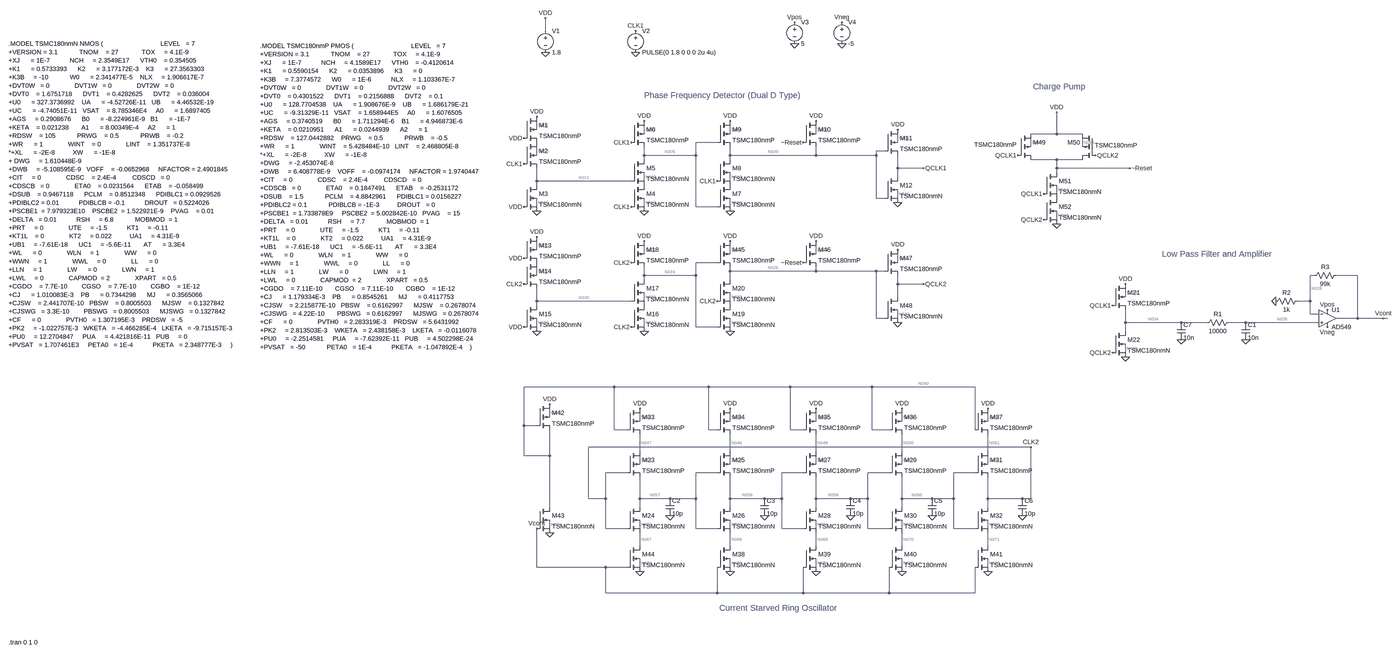
[diagram p0: schematic Clock-Multiplier.asc, whole sheet]
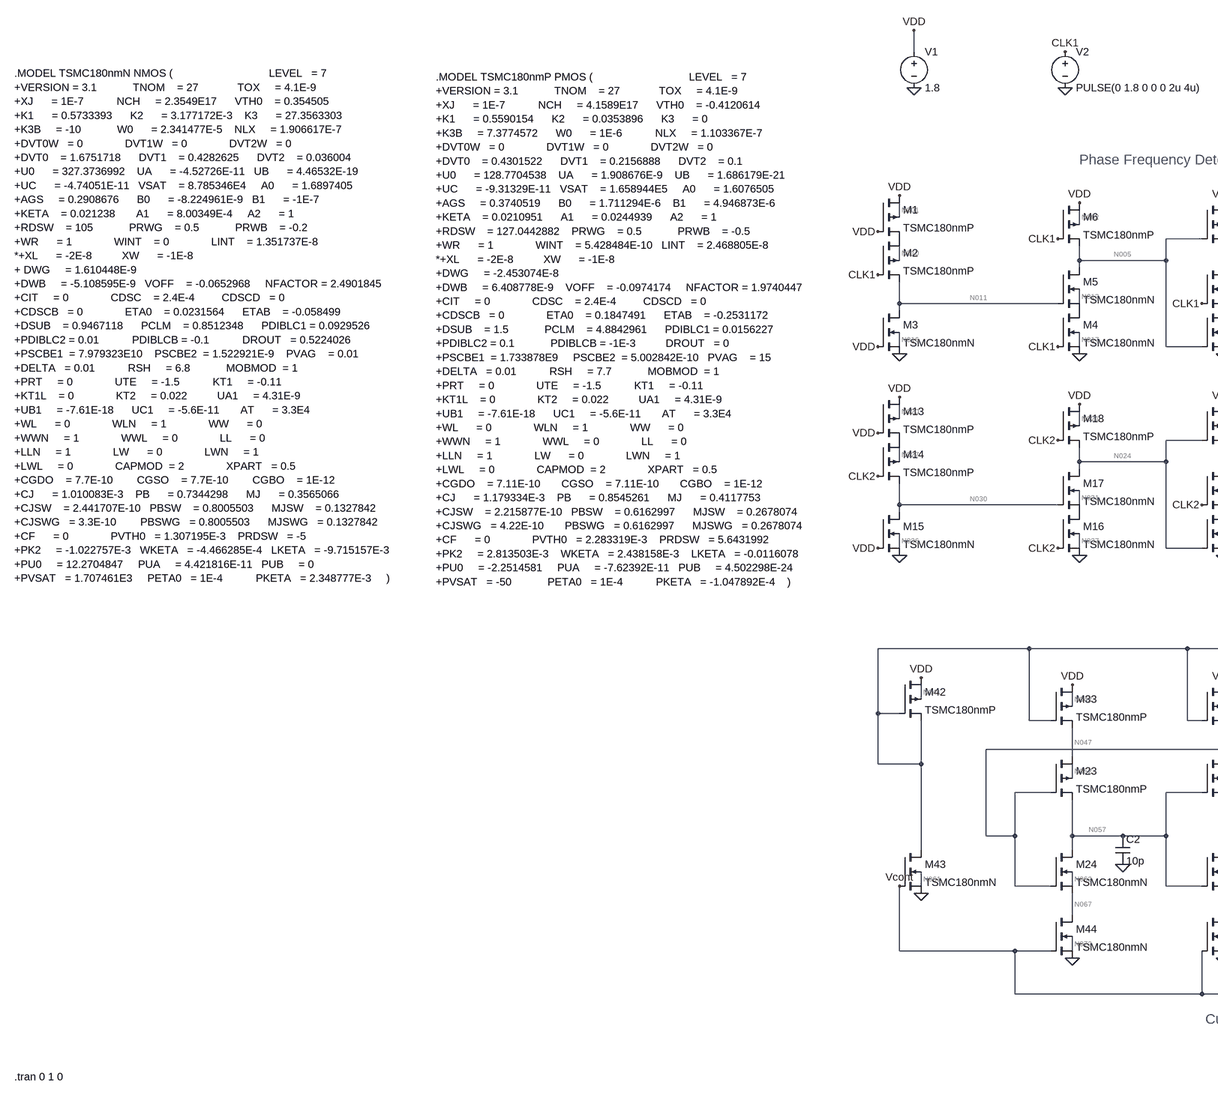
[diagram p1: schematic Clock-Multiplier.asc, part, row 1 of 1, column 1 of 2]
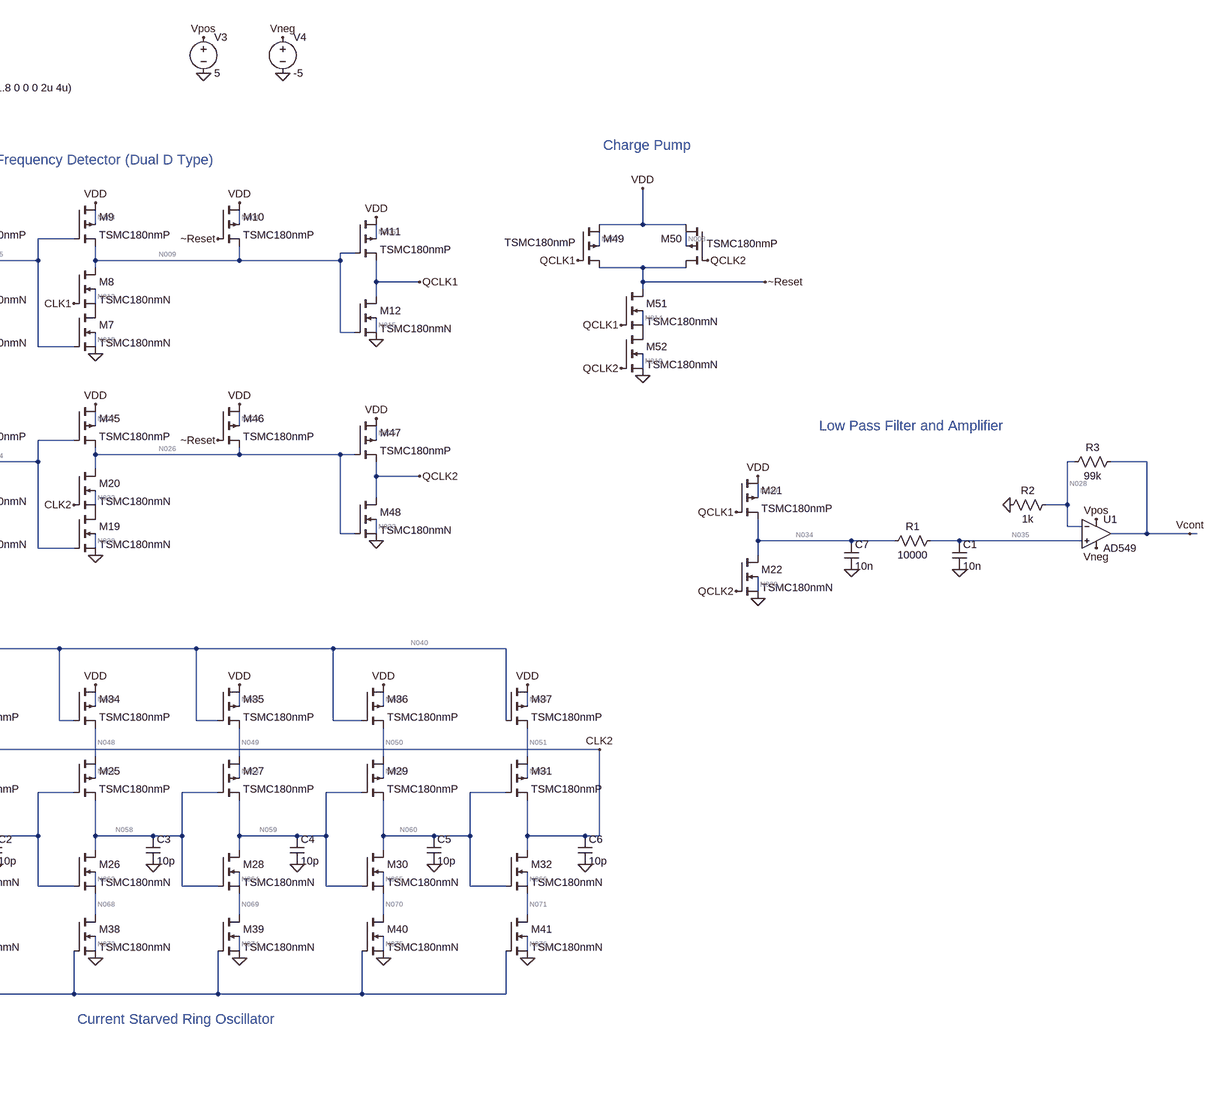
[diagram p2: schematic Clock-Multiplier.asc, part, row 1 of 1, column 2 of 2]
Clock-Multiplier.asc, the LTspice schematic file:
Version 4
SHEET 1 5760 2408
WIRE 1152 -832 1152 -880
WIRE 1120 -464 1120 -496
WIRE 1520 -448 1520 -480
WIRE 1840 -448 1840 -480
WIRE 2160 -448 2160 -480
WIRE 3056 -448 3056 -528
WIRE 3056 -448 2960 -448
WIRE 3152 -448 3056 -448
WIRE 1792 -416 1712 -416
WIRE 2464 -416 2464 -448
WIRE 2960 -400 2960 -432
WIRE 3152 -400 3152 -432
WIRE 2416 -384 2384 -384
WIRE 1120 -368 1120 -400
WIRE 1520 -368 1520 -400
WIRE 1712 -368 1712 -416
WIRE 1712 -368 1520 -368
WIRE 1840 -368 1840 -400
WIRE 2160 -368 2160 -400
WIRE 2160 -368 1840 -368
WIRE 2384 -368 2384 -384
WIRE 2384 -368 2160 -368
WIRE 1520 -352 1520 -368
WIRE 1840 -352 1840 -368
WIRE 3056 -352 2960 -352
WIRE 3152 -352 3056 -352
WIRE 2464 -320 2464 -368
WIRE 2560 -320 2464 -320
WIRE 3056 -320 3056 -352
WIRE 3328 -320 3056 -320
WIRE 3056 -304 3056 -320
WIRE 2464 -288 2464 -320
WIRE 1120 -272 1120 -320
WIRE 1472 -272 1120 -272
WIRE 1520 -272 1520 -304
WIRE 1840 -272 1840 -304
WIRE 1120 -256 1120 -272
WIRE 3056 -224 3056 -256
WIRE 2384 -208 2384 -368
WIRE 2416 -208 2384 -208
WIRE 2464 -208 2464 -240
WIRE 1120 -176 1120 -208
WIRE 1520 -176 1520 -208
WIRE 1712 -176 1712 -368
WIRE 1792 -176 1712 -176
WIRE 1840 -176 1840 -208
WIRE 3056 -128 3056 -160
WIRE 1120 -16 1120 -48
WIRE 1520 0 1520 -32
WIRE 1840 0 1840 -32
WIRE 2160 0 2160 -32
WIRE 1792 32 1712 32
WIRE 2464 32 2464 0
WIRE 1840 64 1840 48
WIRE 2160 64 2160 48
WIRE 2160 64 1840 64
WIRE 2384 64 2160 64
WIRE 2416 64 2384 64
WIRE 1120 80 1120 48
WIRE 1520 80 1520 48
WIRE 1712 80 1712 32
WIRE 1712 80 1520 80
WIRE 4016 80 4000 80
WIRE 4176 80 4096 80
WIRE 1520 96 1520 80
WIRE 1840 96 1840 64
WIRE 2464 112 2464 80
WIRE 2560 112 2464 112
WIRE 2464 160 2464 112
WIRE 3312 160 3312 128
WIRE 1120 176 1120 128
WIRE 1472 176 1120 176
WIRE 1520 176 1520 144
WIRE 1840 176 1840 144
WIRE 4000 176 4000 80
WIRE 4000 176 3952 176
WIRE 1120 192 1120 176
WIRE 4000 224 4000 176
WIRE 4032 224 4000 224
WIRE 2384 240 2384 64
WIRE 2416 240 2384 240
WIRE 2464 240 2464 208
WIRE 4176 240 4176 80
WIRE 4176 240 4096 240
WIRE 4272 240 4176 240
WIRE 4288 240 4272 240
WIRE 3312 256 3312 208
WIRE 3520 256 3312 256
WIRE 3616 256 3520 256
WIRE 3760 256 3696 256
WIRE 4032 256 3760 256
WIRE 1120 272 1120 240
WIRE 1520 272 1520 240
WIRE 1712 272 1712 80
WIRE 1792 272 1712 272
WIRE 1840 272 1840 240
WIRE 3312 288 3312 256
WIRE 3312 368 3312 336
WIRE 1408 496 1072 496
WIRE 1760 496 1408 496
WIRE 2064 496 1760 496
WIRE 2368 496 2064 496
WIRE 2752 496 2368 496
WIRE 1168 608 1168 576
WIRE 1504 624 1504 592
WIRE 1840 624 1840 592
WIRE 2160 624 2160 592
WIRE 2480 624 2480 592
WIRE 2800 624 2800 592
WIRE 1072 640 1072 496
WIRE 1120 640 1072 640
WIRE 1408 656 1408 496
WIRE 1456 656 1408 656
WIRE 1760 656 1760 496
WIRE 1792 656 1760 656
WIRE 2064 656 2064 496
WIRE 2112 656 2064 656
WIRE 2368 656 2368 496
WIRE 2432 656 2368 656
WIRE 2752 656 2752 496
WIRE 2960 720 1312 720
WIRE 1504 736 1504 672
WIRE 1840 736 1840 672
WIRE 2160 736 2160 672
WIRE 2480 736 2480 672
WIRE 2800 736 2800 672
WIRE 1072 752 1072 640
WIRE 1168 752 1168 656
WIRE 1168 752 1072 752
WIRE 1504 784 1504 752
WIRE 1840 784 1840 752
WIRE 2160 784 2160 752
WIRE 2480 784 2480 752
WIRE 2800 784 2800 752
WIRE 1456 816 1376 816
WIRE 1792 816 1712 816
WIRE 2112 816 2032 816
WIRE 2432 816 2352 816
WIRE 2752 816 2672 816
WIRE 1312 912 1312 720
WIRE 1376 912 1376 816
WIRE 1376 912 1312 912
WIRE 1504 912 1504 832
WIRE 1616 912 1504 912
WIRE 1712 912 1712 816
WIRE 1712 912 1616 912
WIRE 1840 912 1840 832
WIRE 1968 912 1840 912
WIRE 2032 912 2032 816
WIRE 2032 912 1968 912
WIRE 2160 912 2160 832
WIRE 2288 912 2160 912
WIRE 2352 912 2352 816
WIRE 2352 912 2288 912
WIRE 2480 912 2480 832
WIRE 2592 912 2480 912
WIRE 2672 912 2672 816
WIRE 2672 912 2592 912
WIRE 2800 912 2800 832
WIRE 2928 912 2800 912
WIRE 2960 912 2960 720
WIRE 2960 912 2928 912
WIRE 1168 944 1168 752
WIRE 1504 944 1504 912
WIRE 1840 944 1840 912
WIRE 2160 944 2160 912
WIRE 2480 944 2480 912
WIRE 2800 944 2800 912
WIRE 1168 1024 1168 992
WIRE 1376 1024 1376 912
WIRE 1456 1024 1376 1024
WIRE 1504 1024 1504 992
WIRE 1712 1024 1712 912
WIRE 1792 1024 1712 1024
WIRE 1840 1024 1840 992
WIRE 2032 1024 2032 912
WIRE 2112 1024 2032 1024
WIRE 2160 1024 2160 992
WIRE 2352 1024 2352 912
WIRE 2432 1024 2352 1024
WIRE 2480 1024 2480 992
WIRE 2672 1024 2672 912
WIRE 2752 1024 2672 1024
WIRE 2800 1024 2800 992
WIRE 1504 1088 1504 1040
WIRE 1840 1088 1840 1040
WIRE 2160 1088 2160 1040
WIRE 2480 1088 2480 1040
WIRE 2800 1088 2800 1040
WIRE 1120 1168 1120 1024
WIRE 1376 1168 1120 1168
WIRE 1456 1168 1376 1168
WIRE 1504 1168 1504 1136
WIRE 1840 1168 1840 1136
WIRE 2160 1168 2160 1136
WIRE 2480 1168 2480 1136
WIRE 2800 1168 2800 1136
WIRE 1376 1264 1376 1168
WIRE 1792 1264 1792 1168
WIRE 1792 1264 1376 1264
WIRE 2112 1264 2112 1168
WIRE 2112 1264 1792 1264
WIRE 2432 1264 2432 1168
WIRE 2432 1264 2112 1264
WIRE 2752 1264 2752 1168
WIRE 2752 1264 2432 1264
FLAG 1152 -880 VDD
FLAG 1152 -752 0
FLAG 1488 -832 CLK1
FLAG 1488 -752 0
FLAG 1840 1184 0
FLAG 2160 1184 0
FLAG 2480 1184 0
FLAG 2800 1184 0
FLAG 1504 576 VDD
FLAG 1840 576 VDD
FLAG 2160 576 VDD
FLAG 2480 576 VDD
FLAG 2800 576 VDD
FLAG 1168 1040 0
FLAG 1504 1184 0
FLAG 1168 560 VDD
FLAG 2960 720 CLK2
FLAG 1120 -160 0
FLAG 1520 -160 0
FLAG 1120 -512 VDD
FLAG 1520 -496 VDD
FLAG 1840 -160 0
FLAG 1840 -496 VDD
FLAG 2160 -496 VDD
FLAG 2464 -464 VDD
FLAG 2464 -192 0
FLAG 1120 288 0
FLAG 1520 288 0
FLAG 1120 -64 VDD
FLAG 1520 -48 VDD
FLAG 1840 288 0
FLAG 1840 -48 VDD
FLAG 2160 -48 VDD
FLAG 2464 -16 VDD
FLAG 2464 256 0
FLAG 1072 -432 VDD
FLAG 1072 -176 VDD
FLAG 1072 -336 CLK1
FLAG 1072 16 VDD
FLAG 1072 272 VDD
FLAG 1472 -416 CLK1
FLAG 1472 -176 CLK1
FLAG 1792 -272 CLK1
FLAG 1072 112 CLK2
FLAG 1472 32 CLK2
FLAG 1472 272 CLK2
FLAG 1792 176 CLK2
FLAG 3056 -112 0
FLAG 3056 -528 VDD
FLAG 2560 -320 QCLK1
FLAG 2560 112 QCLK2
FLAG 2912 -368 QCLK1
FLAG 3008 -224 QCLK1
FLAG 3008 -128 QCLK2
FLAG 3200 -368 QCLK2
FLAG 3328 -320 ~Reset
FLAG 2112 -416 ~Reset
FLAG 2112 32 ~Reset
FLAG 3264 192 QCLK1
FLAG 3264 368 QCLK2
FLAG 3760 320 0
FLAG 1616 976 0
FLAG 1968 976 0
FLAG 2288 976 0
FLAG 2592 976 0
FLAG 2928 976 0
FLAG 3312 112 VDD
FLAG 3312 384 0
FLAG 1120 1024 Vcont
FLAG 3520 320 0
FLAG 2080 -784 0
FLAG 2080 -864 Vpos
FLAG 2256 -784 0
FLAG 2256 -864 Vneg
FLAG 4064 208 Vpos
FLAG 4064 272 Vneg
FLAG 3872 176 0
FLAG 4272 240 Vcont
SYMBOL voltage 1152 -848 R0
WINDOW 123 0 0 Left 0
WINDOW 39 0 0 Left 0
SYMATTR InstName V1
SYMATTR Value 1.8
SYMBOL voltage 1488 -848 R0
WINDOW 123 0 0 Left 0
WINDOW 39 0 0 Left 0
SYMATTR InstName V2
SYMATTR Value PULSE(0 1.8 0 0 0 2u 4u)
SYMBOL pmos4 3264 112 R0
SYMATTR InstName M21
SYMATTR Value TSMC180nmP
SYMBOL nmos4 3264 288 R0
SYMATTR InstName M22
SYMATTR Value TSMC180nmN
SYMBOL pmos4 1456 736 R0
SYMATTR InstName M23
SYMATTR Value TSMC180nmP
SYMBOL nmos4 1456 944 R0
SYMATTR InstName M24
SYMATTR Value TSMC180nmN
SYMBOL pmos4 1792 736 R0
SYMATTR InstName M25
SYMATTR Value TSMC180nmP
SYMBOL nmos4 1792 944 R0
SYMATTR InstName M26
SYMATTR Value TSMC180nmN
SYMBOL pmos4 2112 736 R0
SYMATTR InstName M27
SYMATTR Value TSMC180nmP
SYMBOL nmos4 2112 944 R0
SYMATTR InstName M28
SYMATTR Value TSMC180nmN
SYMBOL pmos4 2432 736 R0
SYMATTR InstName M29
SYMATTR Value TSMC180nmP
SYMBOL nmos4 2432 944 R0
SYMATTR InstName M30
SYMATTR Value TSMC180nmN
SYMBOL pmos4 2752 736 R0
SYMATTR InstName M31
SYMATTR Value TSMC180nmP
SYMBOL nmos4 2752 944 R0
SYMATTR InstName M32
SYMATTR Value TSMC180nmN
SYMBOL pmos4 1456 576 R0
SYMATTR InstName M33
SYMATTR Value TSMC180nmP
SYMBOL pmos4 1792 576 R0
SYMATTR InstName M34
SYMATTR Value TSMC180nmP
SYMBOL pmos4 2112 576 R0
SYMATTR InstName M35
SYMATTR Value TSMC180nmP
SYMBOL pmos4 2432 576 R0
SYMATTR InstName M36
SYMATTR Value TSMC180nmP
SYMBOL pmos4 2752 576 R0
SYMATTR InstName M37
SYMATTR Value TSMC180nmP
SYMBOL nmos4 1792 1088 R0
SYMATTR InstName M38
SYMATTR Value TSMC180nmN
SYMBOL nmos4 2112 1088 R0
SYMATTR InstName M39
SYMATTR Value TSMC180nmN
SYMBOL nmos4 2432 1088 R0
SYMATTR InstName M40
SYMATTR Value TSMC180nmN
SYMBOL nmos4 2752 1088 R0
SYMATTR InstName M41
SYMATTR Value TSMC180nmN
SYMBOL pmos4 1120 560 R0
SYMATTR InstName M42
SYMATTR Value TSMC180nmP
SYMBOL nmos4 1120 944 R0
SYMATTR InstName M43
SYMATTR Value TSMC180nmN
SYMBOL nmos4 1456 1088 R0
SYMATTR InstName M44
SYMATTR Value TSMC180nmN
SYMBOL pmos4 1072 -512 R0
SYMATTR InstName M1
SYMATTR Value TSMC180nmP
SYMBOL pmos4 1072 -416 R0
SYMATTR InstName M2
SYMATTR Value TSMC180nmP
SYMBOL nmos4 1072 -256 R0
SYMATTR InstName M3
SYMATTR Value TSMC180nmN
SYMBOL nmos4 1472 -256 R0
SYMATTR InstName M4
SYMATTR Value TSMC180nmN
SYMBOL nmos4 1472 -352 R0
SYMATTR InstName M5
SYMATTR Value TSMC180nmN
SYMBOL pmos4 1472 -496 R0
SYMATTR InstName M6
SYMATTR Value TSMC180nmP
SYMBOL nmos4 1792 -256 R0
SYMATTR InstName M7
SYMATTR Value TSMC180nmN
SYMBOL nmos4 1792 -352 R0
SYMATTR InstName M8
SYMATTR Value TSMC180nmN
SYMBOL pmos4 1792 -496 R0
SYMATTR InstName M9
SYMATTR Value TSMC180nmP
SYMBOL pmos4 2112 -496 R0
SYMATTR InstName M10
SYMATTR Value TSMC180nmP
SYMBOL pmos4 2416 -464 R0
SYMATTR InstName M11
SYMATTR Value TSMC180nmP
SYMBOL nmos4 2416 -288 R0
SYMATTR InstName M12
SYMATTR Value TSMC180nmN
SYMBOL pmos4 1072 -64 R0
SYMATTR InstName M13
SYMATTR Value TSMC180nmP
SYMBOL pmos4 1072 32 R0
SYMATTR InstName M14
SYMATTR Value TSMC180nmP
SYMBOL nmos4 1072 192 R0
SYMATTR InstName M15
SYMATTR Value TSMC180nmN
SYMBOL nmos4 1472 192 R0
SYMATTR InstName M16
SYMATTR Value TSMC180nmN
SYMBOL nmos4 1472 96 R0
SYMATTR InstName M17
SYMATTR Value TSMC180nmN
SYMBOL pmos4 1472 -48 R0
SYMATTR InstName M18
SYMATTR Value TSMC180nmP
SYMBOL nmos4 1792 192 R0
SYMATTR InstName M19
SYMATTR Value TSMC180nmN
SYMBOL nmos4 1792 96 R0
SYMATTR InstName M20
SYMATTR Value TSMC180nmN
SYMBOL pmos4 1792 -48 R0
SYMATTR InstName M45
SYMATTR Value TSMC180nmP
SYMBOL pmos4 2112 -48 R0
SYMATTR InstName M46
SYMATTR Value TSMC180nmP
SYMBOL pmos4 2416 -16 R0
SYMATTR InstName M47
SYMATTR Value TSMC180nmP
SYMBOL nmos4 2416 160 R0
SYMATTR InstName M48
SYMATTR Value TSMC180nmN
SYMBOL pmos4 2912 -448 R0
WINDOW 3 -163 40 Left 2
SYMATTR InstName M49
SYMATTR Value TSMC180nmP
SYMBOL pmos4 3200 -448 M0
WINDOW 3 -156 43 Left 2
SYMATTR InstName M50
SYMATTR Value TSMC180nmP
SYMBOL nmos4 3008 -304 R0
SYMATTR InstName M51
SYMATTR Value TSMC180nmN
SYMBOL nmos4 3008 -208 R0
SYMATTR InstName M52
SYMATTR Value TSMC180nmN
SYMBOL res 3712 240 R90
WINDOW 0 0 56 VBottom 2
WINDOW 3 32 56 VTop 2
SYMATTR InstName R1
SYMATTR Value 10000
SYMBOL cap 3744 256 R0
SYMATTR InstName C1
SYMATTR Value 10n
SYMBOL cap 1600 912 R0
SYMATTR InstName C2
SYMATTR Value 10p
SYMBOL cap 1952 912 R0
SYMATTR InstName C3
SYMATTR Value 10p
SYMBOL cap 2272 912 R0
SYMATTR InstName C4
SYMATTR Value 10p
SYMBOL cap 2576 912 R0
SYMATTR InstName C5
SYMATTR Value 10p
SYMBOL cap 2912 912 R0
SYMATTR InstName C6
SYMATTR Value 10p
SYMBOL cap 3504 256 R0
SYMATTR InstName C7
SYMATTR Value 10n
SYMBOL Opamps\\AD549 4064 176 R0
SYMATTR InstName U1
SYMBOL voltage 2080 -880 R0
WINDOW 123 0 0 Left 0
WINDOW 39 0 0 Left 0
SYMATTR InstName V3
SYMATTR Value 5
SYMBOL voltage 2256 -880 R0
WINDOW 123 0 0 Left 0
WINDOW 39 0 0 Left 0
SYMATTR InstName V4
SYMATTR Value -5
SYMBOL res 3968 160 R90
WINDOW 0 0 56 VBottom 2
WINDOW 3 32 56 VTop 2
SYMATTR InstName R2
SYMATTR Value 1k
SYMBOL res 4112 64 R90
WINDOW 0 0 56 VBottom 2
WINDOW 3 32 56 VTop 2
SYMATTR InstName R3
SYMATTR Value 99k
TEXT -1072 -784 Left 2 !.MODEL TSMC180nmN NMOS (                                LEVEL   = 7\n+VERSION = 3.1            TNOM    = 27             TOX     = 4.1E-9\n+XJ      = 1E-7           NCH     = 2.3549E17      VTH0    = 0.354505\n+K1      = 0.5733393      K2      = 3.177172E-3    K3      = 27.3563303\n+K3B     = -10            W0      = 2.341477E-5    NLX     = 1.906617E-7\n+DVT0W   = 0              DVT1W   = 0              DVT2W   = 0\n+DVT0    = 1.6751718      DVT1    = 0.4282625      DVT2    = 0.036004\n+U0      = 327.3736992    UA      = -4.52726E-11   UB      = 4.46532E-19\n+UC      = -4.74051E-11   VSAT    = 8.785346E4     A0      = 1.6897405\n+AGS     = 0.2908676      B0      = -8.224961E-9   B1      = -1E-7\n+KETA    = 0.021238       A1      = 8.00349E-4     A2      = 1\n+RDSW    = 105            PRWG    = 0.5            PRWB    = -0.2\n+WR      = 1              WINT    = 0              LINT    = 1.351737E-8\n*+XL      = -2E-8          XW      = -1E-8         \n+ DWG     = 1.610448E-9\n+DWB     = -5.108595E-9   VOFF    = -0.0652968     NFACTOR = 2.4901845\n+CIT     = 0              CDSC    = 2.4E-4         CDSCD   = 0\n+CDSCB   = 0              ETA0    = 0.0231564      ETAB    = -0.058499\n+DSUB    = 0.9467118      PCLM    = 0.8512348      PDIBLC1 = 0.0929526\n+PDIBLC2 = 0.01           PDIBLCB = -0.1           DROUT   = 0.5224026\n+PSCBE1  = 7.979323E10    PSCBE2  = 1.522921E-9    PVAG    = 0.01\n+DELTA   = 0.01           RSH     = 6.8            MOBMOD  = 1\n+PRT     = 0              UTE     = -1.5           KT1     = -0.11\n+KT1L    = 0              KT2     = 0.022          UA1     = 4.31E-9\n+UB1     = -7.61E-18      UC1     = -5.6E-11       AT      = 3.3E4\n+WL      = 0              WLN     = 1              WW      = 0\n+WWN     = 1              WWL     = 0              LL      = 0\n+LLN     = 1              LW      = 0              LWN     = 1\n+LWL     = 0              CAPMOD  = 2              XPART   = 0.5\n+CGDO    = 7.7E-10        CGSO    = 7.7E-10        CGBO    = 1E-12\n+CJ      = 1.010083E-3    PB      = 0.7344298      MJ      = 0.3565066\n+CJSW    = 2.441707E-10   PBSW    = 0.8005503      MJSW    = 0.1327842\n+CJSWG   = 3.3E-10        PBSWG   = 0.8005503      MJSWG   = 0.1327842\n+CF      = 0              PVTH0   = 1.307195E-3    PRDSW   = -5\n+PK2     = -1.022757E-3   WKETA   = -4.466285E-4   LKETA   = -9.715157E-3\n+PU0     = 12.2704847     PUA     = 4.421816E-11   PUB     = 0\n+PVSAT   = 1.707461E3     PETA0   = 1E-4           PKETA   = 2.348777E-3     )
TEXT -120 -776 Left 2 !.MODEL TSMC180nmP PMOS (                                LEVEL   = 7\n+VERSION = 3.1            TNOM    = 27             TOX     = 4.1E-9\n+XJ      = 1E-7           NCH     = 4.1589E17      VTH0    = -0.4120614\n+K1      = 0.5590154      K2      = 0.0353896      K3      = 0\n+K3B     = 7.3774572      W0      = 1E-6           NLX     = 1.103367E-7\n+DVT0W   = 0              DVT1W   = 0              DVT2W   = 0\n+DVT0    = 0.4301522      DVT1    = 0.2156888      DVT2    = 0.1\n+U0      = 128.7704538    UA      = 1.908676E-9    UB      = 1.686179E-21\n+UC      = -9.31329E-11   VSAT    = 1.658944E5     A0      = 1.6076505\n+AGS     = 0.3740519      B0      = 1.711294E-6    B1      = 4.946873E-6\n+KETA    = 0.0210951      A1      = 0.0244939      A2      = 1\n+RDSW    = 127.0442882    PRWG    = 0.5            PRWB    = -0.5\n+WR      = 1              WINT    = 5.428484E-10   LINT    = 2.468805E-8\n*+XL      = -2E-8          XW      = -1E-8          \n+DWG     = -2.453074E-8\n+DWB     = 6.408778E-9    VOFF    = -0.0974174     NFACTOR = 1.9740447\n+CIT     = 0              CDSC    = 2.4E-4         CDSCD   = 0\n+CDSCB   = 0              ETA0    = 0.1847491      ETAB    = -0.2531172\n+DSUB    = 1.5            PCLM    = 4.8842961      PDIBLC1 = 0.0156227\n+PDIBLC2 = 0.1            PDIBLCB = -1E-3          DROUT   = 0\n+PSCBE1  = 1.733878E9     PSCBE2  = 5.002842E-10   PVAG    = 15\n+DELTA   = 0.01           RSH     = 7.7            MOBMOD  = 1\n+PRT     = 0              UTE     = -1.5           KT1     = -0.11\n+KT1L    = 0              KT2     = 0.022          UA1     = 4.31E-9\n+UB1     = -7.61E-18      UC1     = -5.6E-11       AT      = 3.3E4\n+WL      = 0              WLN     = 1              WW      = 0\n+WWN     = 1              WWL     = 0              LL      = 0\n+LLN     = 1              LW      = 0              LWN     = 1\n+LWL     = 0              CAPMOD  = 2              XPART   = 0.5\n+CGDO    = 7.11E-10       CGSO    = 7.11E-10       CGBO    = 1E-12\n+CJ      = 1.179334E-3    PB      = 0.8545261      MJ      = 0.4117753\n+CJSW    = 2.215877E-10   PBSW    = 0.6162997      MJSW    = 0.2678074\n+CJSWG   = 4.22E-10       PBSWG   = 0.6162997      MJSWG   = 0.2678074\n+CF      = 0              PVTH0   = 2.283319E-3    PRDSW   = 5.6431992\n+PK2     = 2.813503E-3    WKETA   = 2.438158E-3    LKETA   = -0.0116078\n+PU0     = -2.2514581     PUA     = -7.62392E-11   PUB     = 4.502298E-24\n+PVSAT   = -50            PETA0   = 1E-4           PKETA   = -1.047892E-4    )
TEXT -1072 1448 Left 2 !.tran 0 1 0
TEXT 1800 1320 Left 3 ;Current Starved Ring Oscillator
TEXT 1520 -592 Left 3 ;Phase Frequency Detector (Dual D Type)
TEXT 2968 -624 Left 3 ;Charge Pump
TEXT 3448 0 Left 3 ;Low Pass Filter and Amplifier

The netlist it stands for:
* Clock-Multiplier.asc
V1 VDD 0 1.8
V2 CLK1 0 PULSE(0 1.8 0 0 0 2u 4u)
M21 VDD QCLK1 N034 N029 TSMC180nmP
M22 N034 QCLK2 0 N039 TSMC180nmN
M23 N047 CLK2 N057 N052 TSMC180nmP
M24 N057 CLK2 N067 N062 TSMC180nmN
M25 N048 N057 N058 N053 TSMC180nmP
M26 N058 N057 N068 N063 TSMC180nmN
M27 N049 N058 N059 N054 TSMC180nmP
M28 N059 N058 N069 N064 TSMC180nmN
M29 N050 N059 N060 N055 TSMC180nmP
M30 N060 N059 N070 N065 TSMC180nmN
M31 N051 N060 CLK2 N056 TSMC180nmP
M32 CLK2 N060 N071 N066 TSMC180nmN
M33 VDD N040 N047 N042 TSMC180nmP
M34 VDD N040 N048 N043 TSMC180nmP
M35 VDD N040 N049 N044 TSMC180nmP
M36 VDD N040 N050 N045 TSMC180nmP
M37 VDD N040 N051 N046 TSMC180nmP
M38 N068 Vcont 0 N073 TSMC180nmN
M39 N069 Vcont 0 N074 TSMC180nmN
M40 N070 Vcont 0 N075 TSMC180nmN
M41 N071 Vcont 0 N076 TSMC180nmN
M42 VDD N040 N040 N041 TSMC180nmP
M43 N040 Vcont 0 N061 TSMC180nmN
M44 N067 Vcont 0 N072 TSMC180nmN
M1 VDD VDD P001 N001 TSMC180nmP
M2 P001 CLK1 N011 N010 TSMC180nmP
M3 N011 VDD 0 N016 TSMC180nmN
M4 P002 CLK1 0 N017 TSMC180nmN
M5 N005 N011 P002 N012 TSMC180nmN
M6 VDD CLK1 N005 N002 TSMC180nmP
M7 P003 N005 0 N018 TSMC180nmN
M8 N009 CLK1 P003 N013 TSMC180nmN
M9 VDD N005 N009 N003 TSMC180nmP
M10 VDD ~Reset N009 N004 TSMC180nmP
M11 VDD N009 QCLK1 N006 TSMC180nmP
M12 QCLK1 N009 0 N015 TSMC180nmN
M13 VDD VDD P004 N020 TSMC180nmP
M14 P004 CLK2 N030 N027 TSMC180nmP
M15 N030 VDD 0 N036 TSMC180nmN
M16 P005 CLK2 0 N037 TSMC180nmN
M17 N024 N030 P005 N031 TSMC180nmN
M18 VDD CLK2 N024 N021 TSMC180nmP
M19 P006 N024 0 N038 TSMC180nmN
M20 N026 CLK2 P006 N032 TSMC180nmN
M45 VDD N024 N026 N022 TSMC180nmP
M46 VDD ~Reset N026 N023 TSMC180nmP
M47 VDD N026 QCLK2 N025 TSMC180nmP
M48 QCLK2 N026 0 N033 TSMC180nmN
M49 VDD QCLK1 ~Reset N007 TSMC180nmP
M50 VDD QCLK2 ~Reset N008 TSMC180nmP
M51 ~Reset QCLK1 P007 N014 TSMC180nmN
M52 P007 QCLK2 0 N019 TSMC180nmN
R1 N035 N034 10000
C1 N035 0 10n
C2 N057 0 10p
C3 N058 0 10p
C4 N059 0 10p
C5 N060 0 10p
C6 CLK2 0 10p
C7 N034 0 10n
XU1 N035 N028 Vpos Vneg Vcont AD549  ; pins In+ In- V+ V- OUT
V3 Vpos 0 5
V4 Vneg 0 -5
R2 N028 0 1k
R3 Vcont N028 99k
.model NMOS NMOS
.model PMOS PMOS
.lib standard.mos
.MODEL TSMC180nmN NMOS (                                LEVEL   = 7
+VERSION = 3.1            TNOM    = 27             TOX     = 4.1E-9
+XJ      = 1E-7           NCH     = 2.3549E17      VTH0    = 0.354505
+K1      = 0.5733393      K2      = 3.177172E-3    K3      = 27.3563303
+K3B     = -10            W0      = 2.341477E-5    NLX     = 1.906617E-7
+DVT0W   = 0              DVT1W   = 0              DVT2W   = 0
+DVT0    = 1.6751718      DVT1    = 0.4282625      DVT2    = 0.036004
+U0      = 327.3736992    UA      = -4.52726E-11   UB      = 4.46532E-19
+UC      = -4.74051E-11   VSAT    = 8.785346E4     A0      = 1.6897405
+AGS     = 0.2908676      B0      = -8.224961E-9   B1      = -1E-7
+KETA    = 0.021238       A1      = 8.00349E-4     A2      = 1
+RDSW    = 105            PRWG    = 0.5            PRWB    = -0.2
+WR      = 1              WINT    = 0              LINT    = 1.351737E-8
*+XL      = -2E-8          XW      = -1E-8
+ DWG     = 1.610448E-9
+DWB     = -5.108595E-9   VOFF    = -0.0652968     NFACTOR = 2.4901845
+CIT     = 0              CDSC    = 2.4E-4         CDSCD   = 0
+CDSCB   = 0              ETA0    = 0.0231564      ETAB    = -0.058499
+DSUB    = 0.9467118      PCLM    = 0.8512348      PDIBLC1 = 0.0929526
+PDIBLC2 = 0.01           PDIBLCB = -0.1           DROUT   = 0.5224026
+PSCBE1  = 7.979323E10    PSCBE2  = 1.522921E-9    PVAG    = 0.01
+DELTA   = 0.01           RSH     = 6.8            MOBMOD  = 1
+PRT     = 0              UTE     = -1.5           KT1     = -0.11
+KT1L    = 0              KT2     = 0.022          UA1     = 4.31E-9
+UB1     = -7.61E-18      UC1     = -5.6E-11       AT      = 3.3E4
+WL      = 0              WLN     = 1              WW      = 0
+WWN     = 1              WWL     = 0              LL      = 0
+LLN     = 1              LW      = 0              LWN     = 1
+LWL     = 0              CAPMOD  = 2              XPART   = 0.5
+CGDO    = 7.7E-10        CGSO    = 7.7E-10        CGBO    = 1E-12
+CJ      = 1.010083E-3    PB      = 0.7344298      MJ      = 0.3565066
+CJSW    = 2.441707E-10   PBSW    = 0.8005503      MJSW    = 0.1327842
+CJSWG   = 3.3E-10        PBSWG   = 0.8005503      MJSWG   = 0.1327842
+CF      = 0              PVTH0   = 1.307195E-3    PRDSW   = -5
+PK2     = -1.022757E-3   WKETA   = -4.466285E-4   LKETA   = -9.715157E-3
+PU0     = 12.2704847     PUA     = 4.421816E-11   PUB     = 0
+PVSAT   = 1.707461E3     PETA0   = 1E-4           PKETA   = 2.348777E-3     )
.MODEL TSMC180nmP PMOS (                                LEVEL   = 7
+VERSION = 3.1            TNOM    = 27             TOX     = 4.1E-9
+XJ      = 1E-7           NCH     = 4.1589E17      VTH0    = -0.4120614
+K1      = 0.5590154      K2      = 0.0353896      K3      = 0
+K3B     = 7.3774572      W0      = 1E-6           NLX     = 1.103367E-7
+DVT0W   = 0              DVT1W   = 0              DVT2W   = 0
+DVT0    = 0.4301522      DVT1    = 0.2156888      DVT2    = 0.1
+U0      = 128.7704538    UA      = 1.908676E-9    UB      = 1.686179E-21
+UC      = -9.31329E-11   VSAT    = 1.658944E5     A0      = 1.6076505
+AGS     = 0.3740519      B0      = 1.711294E-6    B1      = 4.946873E-6
+KETA    = 0.0210951      A1      = 0.0244939      A2      = 1
+RDSW    = 127.0442882    PRWG    = 0.5            PRWB    = -0.5
+WR      = 1              WINT    = 5.428484E-10   LINT    = 2.468805E-8
*+XL      = -2E-8          XW      = -1E-8
+DWG     = -2.453074E-8
+DWB     = 6.408778E-9    VOFF    = -0.0974174     NFACTOR = 1.9740447
+CIT     = 0              CDSC    = 2.4E-4         CDSCD   = 0
+CDSCB   = 0              ETA0    = 0.1847491      ETAB    = -0.2531172
+DSUB    = 1.5            PCLM    = 4.8842961      PDIBLC1 = 0.0156227
+PDIBLC2 = 0.1            PDIBLCB = -1E-3          DROUT   = 0
+PSCBE1  = 1.733878E9     PSCBE2  = 5.002842E-10   PVAG    = 15
+DELTA   = 0.01           RSH     = 7.7            MOBMOD  = 1
+PRT     = 0              UTE     = -1.5           KT1     = -0.11
+KT1L    = 0              KT2     = 0.022          UA1     = 4.31E-9
+UB1     = -7.61E-18      UC1     = -5.6E-11       AT      = 3.3E4
+WL      = 0              WLN     = 1              WW      = 0
+WWN     = 1              WWL     = 0              LL      = 0
+LLN     = 1              LW      = 0              LWN     = 1
+LWL     = 0              CAPMOD  = 2              XPART   = 0.5
+CGDO    = 7.11E-10       CGSO    = 7.11E-10       CGBO    = 1E-12
+CJ      = 1.179334E-3    PB      = 0.8545261      MJ      = 0.4117753
+CJSW    = 2.215877E-10   PBSW    = 0.6162997      MJSW    = 0.2678074
+CJSWG   = 4.22E-10       PBSWG   = 0.6162997      MJSWG   = 0.2678074
+CF      = 0              PVTH0   = 2.283319E-3    PRDSW   = 5.6431992
+PK2     = 2.813503E-3    WKETA   = 2.438158E-3    LKETA   = -0.0116078
+PU0     = -2.2514581     PUA     = -7.62392E-11   PUB     = 4.502298E-24
+PVSAT   = -50            PETA0   = 1E-4           PKETA   = -1.047892E-4    )
.tran 0 1 0
* Current Starved Ring Oscillator
* Phase Frequency Detector (Dual D Type)
* Charge Pump
* Low Pass Filter and Amplifier
.backanno
.end

* Results of the author's LTspice run, read from the files saved beside the schematic
* Operating Point, zero values left out:
*   V(vdd) = 1.8 V
*   V(qclk1) = 427.6 mV
*   V(n034) = 68.21 mV
*   V(n029) = 1.652 V
*   V(qclk2) = 1.8 V
*   V(n039) = 21.27 mV
*   V(n047) = 1.662 V
*   V(clk2) = 668.9 mV
*   V(n057) = 668.9 mV
*   V(n052) = 1.522 V
*   V(n067) = 16.04 mV
*   V(n062) = 109.8 mV
*   V(n048) = 1.662 V
*   V(n058) = 668.9 mV
*   V(n053) = 1.522 V
*   V(n068) = 16.04 mV
*   V(n063) = 109.8 mV
*   V(n049) = 1.662 V
*   V(n059) = 668.9 mV
*   V(n054) = 1.522 V
*   V(n069) = 16.04 mV
*   V(n064) = 109.8 mV
*   V(n050) = 1.662 V
*   V(n060) = 668.9 mV
*   V(n055) = 1.522 V
*   V(n070) = 16.04 mV
*   V(n065) = 109.8 mV
*   V(n051) = 1.662 V
*   V(n056) = 1.522 V
*   V(n071) = 16.04 mV
*   V(n066) = 109.8 mV
*   V(n040) = 68.39 mV
*   V(n042) = 1.669 V
*   V(n043) = 1.669 V
*   V(n044) = 1.669 V
*   V(n045) = 1.669 V
*   V(n046) = 1.669 V
*   V(vcont) = 3.396 V
*   V(n073) = 5.637 mV
*   V(n074) = 5.637 mV
*   V(n075) = 5.637 mV
*   V(n076) = 5.637 mV
*   V(n041) = 1.652 V
*   V(n061) = 21.32 mV
*   V(n072) = 5.637 mV
*   V(p001) = 52.64 mV
*   V(n001) = 1.651 V
*   V(n011) = 23.94 nV
*   V(n010) = 22.82 mV
*   V(n016) = 8.798 nV
*   V(p002) = 50.95 mV
*   V(n017) = 16.47 mV
*   V(n005) = 1.8 V
*   V(n012) = 177.6 mV
*   V(n002) = 1.689 V
*   V(p003) = 48.11 nV
*   V(n018) = 17.68 nV
*   V(n009) = 703.5 mV
*   V(n013) = 97.37 mV
*   V(n003) = 1.657 V
*   V(~reset) = 1.789 V
*   V(n004) = 1.657 V
*   V(n006) = 1.655 V
*   V(n015) = 78.87 mV
*   V(p004) = 676.2 mV
*   V(n020) = 1.657 V
*   V(n030) = 19.68 nV
*   V(n027) = 556.7 mV
*   V(n036) = 7.232 nV
*   V(p005) = 315.6 nV
*   V(n037) = 116 nV
*   V(n024) = 1.8 V
*   V(n031) = 128.4 mV
*   V(n021) = 1.689 V
*   V(p006) = 54.94 nV
*   V(n038) = 20.19 nV
*   V(n026) = 312.9 nV
*   V(n032) = 135.2 nV
*   V(n022) = 1.651 V
*   V(n023) = 1.651 V
*   V(n025) = 1.689 V
*   V(n033) = 128.4 mV
*   V(n007) = 1.684 V
*   V(n008) = 1.684 V
*   V(p007) = 1.876 mV
*   V(n014) = 130.1 mV
*   V(n019) = 685.9 µV
*   V(n035) = 68.21 mV
*   V(n028) = 33.96 mV
*   V(vpos) = 5 V
*   V(vneg) = -5 V
*   Id(M52) = 661.3 nA
*   Is(M52) = -661.3 nA
*   Id(M51) = 661.3 nA
*   Is(M51) = -661.3 nA
*   Id(M48) = 23.83 pA
*   Is(M48) = -23.7 pA
*   Id(M20) = 19.37 pA
*   Is(M20) = -19.37 pA
*   Id(M19) = 19.37 pA
*   Is(M19) = -19.37 pA
*   Id(M17) = 23.83 pA
*   Is(M17) = -23.7 pA
*   Id(M16) = 23.7 pA
*   Is(M16) = -23.7 pA
*   Id(M15) = 6.94 pA
*   Is(M15) = -6.94 pA
*   Id(M12) = 12.93 µA
*   Is(M12) = -12.93 µA
*   Id(M8) = 17.06 pA
*   Is(M8) = -16.96 pA
*   Id(M7) = 16.96 pA
*   Is(M7) = -16.96 pA
*   Id(M5) = 7.413 pA
*   Is(M5) = -7.235 pA
*   Id(M4) = 7.235 pA
*   Is(M4) = -7.219 pA
*   Id(M3) = 8.442 pA
*   Is(M3) = -8.442 pA
*   Id(M44) = 9.686 µA
*   Is(M44) = -9.686 µA
*   Id(M43) = 40.99 µA
*   Is(M43) = -40.99 µA
*   Id(M41) = 9.686 µA
*   Is(M41) = -9.686 µA
*   Id(M40) = 9.686 µA
*   Is(M40) = -9.686 µA
*   Id(M39) = 9.686 µA
*   Is(M39) = -9.686 µA
*   Id(M38) = 9.686 µA
*   Is(M38) = -9.686 µA
*   Id(M32) = 9.686 µA
*   Is(M32) = -9.686 µA
*   Id(M30) = 9.686 µA
*   Is(M30) = -9.686 µA
*   Id(M28) = 9.686 µA
*   Is(M28) = -9.686 µA
*   Id(M26) = 9.686 µA
*   Is(M26) = -9.686 µA
*   Id(M24) = 9.686 µA
*   Is(M24) = -9.686 µA
*   Id(M22) = 23.41 µA
*   Is(M22) = -23.41 µA
*   Id(M50) = 3.167 pA
*   Ib(M50) = -1.684 pA
*   Is(M50) = -1.483 pA
*   Id(M49) = 661.3 nA
*   Ib(M49) = -1.684 pA
*   Is(M49) = -661.3 nA
*   Id(M47) = 25.52 pA
*   Ib(M47) = -1.689 pA
*   Is(M47) = -23.83 pA
*   Id(M46) = 12.48 pA
*   Ib(M46) = -1.651 pA
*   Is(M46) = -10.83 pA
*   Id(M45) = 10.2 pA
*   Ib(M45) = -1.651 pA
*   Is(M45) = -8.545 pA
*   Id(M18) = 25.52 pA
*   Ib(M18) = -1.689 pA
*   Is(M18) = -23.83 pA
*   Id(M14) = 7.497 pA
*   Is(M14) = -6.94 pA
*   Id(M13) = 9.154 pA
*   Ib(M13) = -1.657 pA
*   Is(M13) = -7.497 pA
*   Id(M11) = 12.93 µA
*   Ib(M11) = -1.655 pA
*   Is(M11) = -12.93 µA
*   Id(M10) = 11.27 pA
*   Ib(M10) = -1.657 pA
*   Is(M10) = -9.609 pA
*   Id(M9) = 9.11 pA
*   Ib(M9) = -1.657 pA
*   Is(M9) = -7.453 pA
*   Id(M6) = 9.101 pA
*   Ib(M6) = -1.689 pA
*   Is(M6) = -7.413 pA
*   Id(M2) = 8.465 pA
*   Is(M2) = -8.442 pA
*   Id(M1) = 10.12 pA
*   Ib(M1) = -1.651 pA
*   Is(M1) = -8.465 pA
*   Id(M42) = 40.99 µA
*   Ib(M42) = -1.652 pA
*   Is(M42) = -40.99 µA
*   Id(M37) = 9.686 µA
*   Ib(M37) = -1.669 pA
*   Is(M37) = -9.686 µA
*   Id(M36) = 9.686 µA
*   Ib(M36) = -1.669 pA
*   Is(M36) = -9.686 µA
*   Id(M35) = 9.686 µA
*   Ib(M35) = -1.669 pA
*   Is(M35) = -9.686 µA
*   Id(M34) = 9.686 µA
*   Ib(M34) = -1.669 pA
*   Is(M34) = -9.686 µA
*   Id(M33) = 9.686 µA
*   Ib(M33) = -1.669 pA
*   Is(M33) = -9.686 µA
*   Id(M31) = 9.686 µA
*   Ib(M31) = -1.522 pA
*   Is(M31) = -9.686 µA
*   Id(M29) = 9.686 µA
*   Ib(M29) = -1.522 pA
*   Is(M29) = -9.686 µA
*   Id(M27) = 9.686 µA
*   Ib(M27) = -1.522 pA
*   Is(M27) = -9.686 µA
*   Id(M25) = 9.686 µA
*   Ib(M25) = -1.522 pA
*   Is(M25) = -9.686 µA
*   Id(M23) = 9.686 µA
*   Ib(M23) = -1.522 pA
*   Is(M23) = -9.686 µA
*   Id(M21) = 23.41 µA
*   Ib(M21) = -1.652 pA
*   Is(M21) = -23.41 µA
*   I(R3) = 33.96 µA
*   I(R2) = 33.96 µA
*   I(V4) = 783.7 µA
*   I(V3) = -816.4 µA
*   I(V1) = -126.4 µA
*   Ix(u1:3) = 816.4 µA
*   Ix(u1:4) = -783.7 µA
*   Ix(u1:5) = -33.96 µA